# Altium schematic sheet Cigarette-Smoke-Detection-and-Odor-Neutralization-Robot.SchDoc
size A4; SheetNumber: 1; SheetTotal: 1
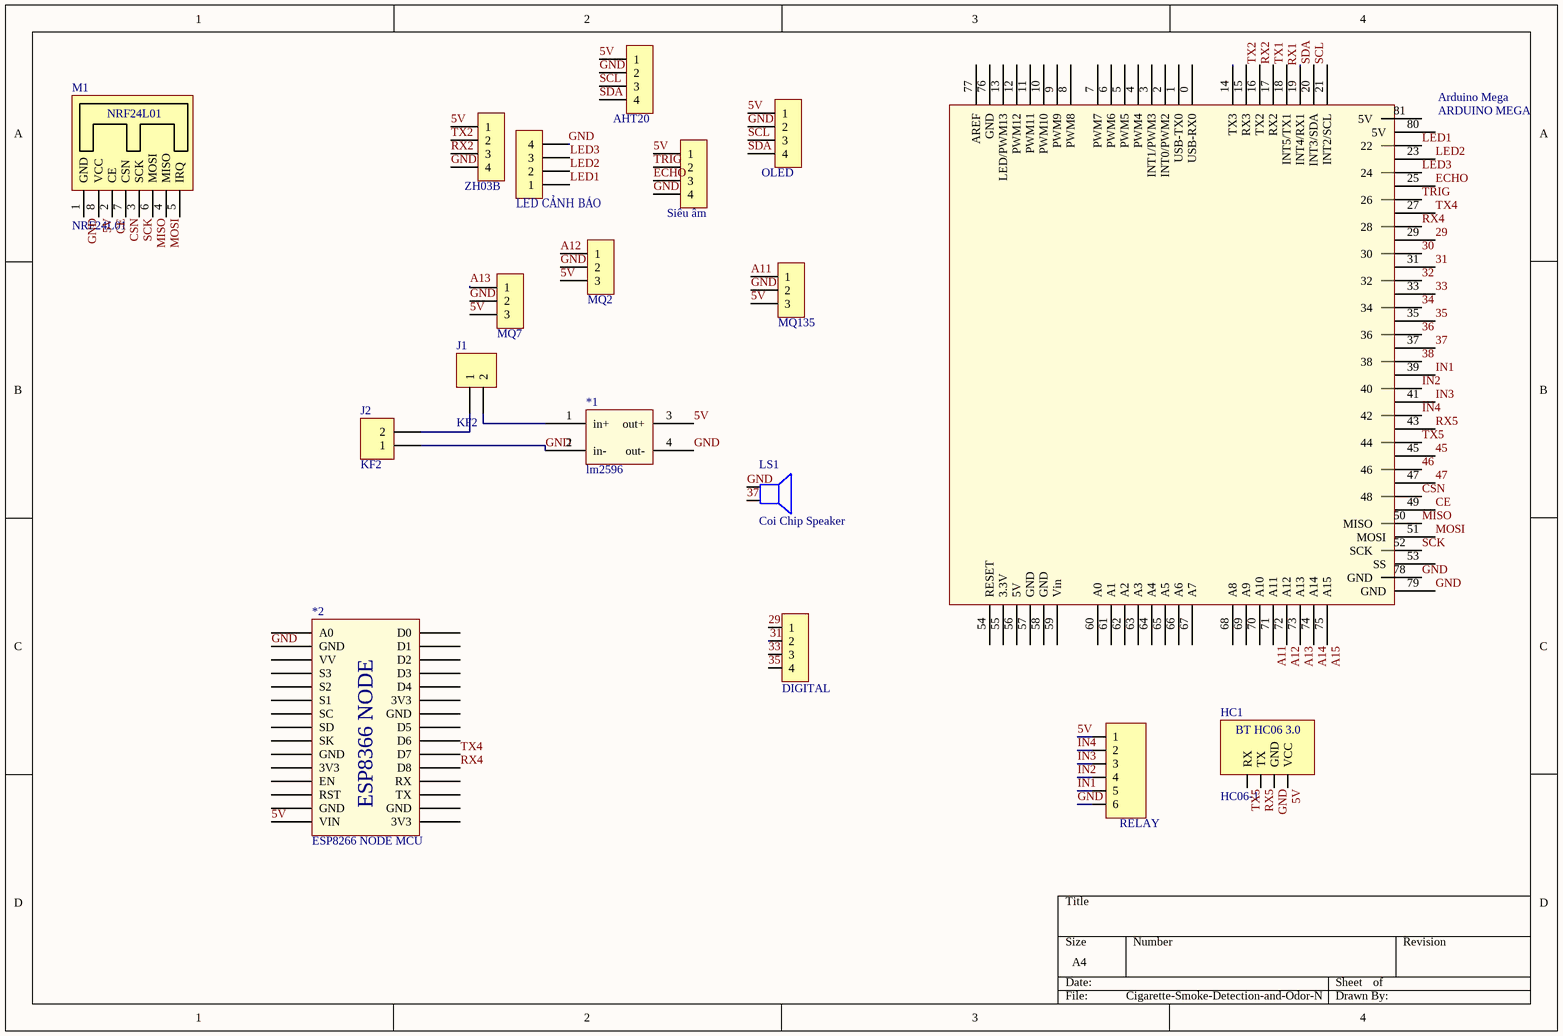
[diagram p0: Cigarette-Smoke-Detection-and-Odor-Neutralization-Robot.SchDoc]

## Parts
*1  lm2596  [PCBComponent_1]
*2  ESP8266 NODE MCU  [ESP8266 NODE MCU]
Arduino_Mega  ARDUINO MEGA  [ARDUINO MEGA]
H1  AHT20  [XH2.54M-4]
H2  OLED  [XH2.54M-4]
H3  ZH03B  [XH2.54M-4]
H4  LED CẢNH BÁO  [XH2.54M-4]
H5  Siêu âm  [XH2.54M-4]
H6  MQ2  [XH2.54M-3]
H7  MQ135  [XH2.54M-3]
H8  MQ7  [XH2.54M-3]
H9  RELAY  [JP 1x6 DT]
HC1  HC06-1  [HC06-1]
J1  KF2  [KF2-3.5]
J2  KF2  [KF2-3.5]
JP1  DIGITAL  [JP 1x4 DT]
LS1  Coi Chip Speaker  [Coi Chip Speacker]
M1  NRF24L01  [NRF24L01]

## Nets
5V: *1.3(out+) *2.15(VIN) H1.1 H2.1 H3.1 H5.1 H6.3 H7.3 H8.3 H9.1 HC1.4(VCC) M1.8(VCC)
29: Arduino_Mega.29 JP1.1
30: Arduino_Mega.30
31: Arduino_Mega.31 JP1.2
32: Arduino_Mega.32
33: Arduino_Mega.33 JP1.3
34: Arduino_Mega.34
35: Arduino_Mega.35 JP1.4
36: Arduino_Mega.36
37: Arduino_Mega.37 LS1.2
38: Arduino_Mega.38
45: Arduino_Mega.45
46: Arduino_Mega.46
47: Arduino_Mega.47
A11: Arduino_Mega.71(A11) H7.1
A12: Arduino_Mega.72(A12) H6.1
A13: Arduino_Mega.73(A13) H8.1
A14: Arduino_Mega.74(A14)
A15: Arduino_Mega.75(A15)
CE: Arduino_Mega.49 M1.2(CE)
CSN: Arduino_Mega.48 M1.7(CSN)
ECHO: Arduino_Mega.25 H5.3
GND: *1.2(in-) *1.4(out-) *2.2(GND) Arduino_Mega.78(GND) Arduino_Mega.79(GND) H1.2 H2.2 H3.4 H4.4 H5.4 H6.2 H7.2 H8.2 H9.6 HC1.3(GND) J2.1 LS1.1 M1.1(GND)
IN1: Arduino_Mega.39 H9.5
IN2: Arduino_Mega.40 H9.4
IN3: Arduino_Mega.41 H9.3
IN4: Arduino_Mega.42 H9.2
LED1: Arduino_Mega.22 H4.1
LED2: Arduino_Mega.23 H4.2
LED3: Arduino_Mega.24 H4.3
MISO: Arduino_Mega.50(MISO) M1.6(MOSI)
MOSI: Arduino_Mega.51(MOSI) M1.4(MISO)
RX1: Arduino_Mega.19(INT4/RX1)
RX2: Arduino_Mega.17(RX2) H3.3
RX4: *2.20(D8) Arduino_Mega.28
RX5: Arduino_Mega.43 HC1.2(TX)
SCK: Arduino_Mega.52(SCK) M1.3(SCK)
SCL: Arduino_Mega.21(INT2/SCL) H1.3 H2.3
SDA: Arduino_Mega.20(INT3/SDA) H1.4 H2.4
TRIG: Arduino_Mega.26 H5.2
TX1: Arduino_Mega.18(INT5/TX1)
TX2: Arduino_Mega.16(TX2) H3.2
TX4: *2.21(D7) Arduino_Mega.27
TX5: Arduino_Mega.44 HC1.1(RX)
Net*1_1: *1.1(in+) J1.2
NetJ1_1: J1.1 J2.2

Not connected (* = marked no-connect by the designer): *2 1(A0) 3(VV) 4(S3) 5(S2) 6(S1) 7(SC) 8(SD) 9(SK) 10(GND) 11(3V3) 12(EN) 13(RST) 14(GND) 16(3V3) 17(GND) 18(TX) 19(RX) 22(D6) 23(D5) 24(GND) 25(3V3) 26(D4) 27(D3) 28(D2) 29(D1) 30(D0); Arduino_Mega 0(USB-RX0) 1(USB-TX0) 2(INT0/PWM2) 3(INT1/PWM3) 4(PWM4) 5(PWM5) 6(PWM6) 7(PWM7) 8(PWM8) 9(PWM9) 10(PWM10) 11(PWM11) 12(PWM12) 13(LED/PWM13) 14(TX3) 15(RX3) 53(SS) 54(RESET) 55(3.3V) 56(5V) 57(GND) 58(GND) 59(Vin) 60(A0) 61(A1) 62(A2) 63(A3) 64(A4) 65(A5) 66(A6) 67(A7) 68(A8) 69(A9) 70(A10) 76(GND) 77(AREF) 80(5V) 81(5V); M1 5(IRQ)

## Notes on the sheet
- (in symbol ESP8266 NODE MCU) ESP8366 NODE
- (in symbol HC06-1) BT HC06 3.0

## Library data of the parts
H1-H5 = Header 4P 2.54 Duc Thang: Cắm; Ten_Linh_Kien: Header 4P XH2.54-4P Đực Thẳng; Don_Vi: Con; Ma_Hang: MH001285; Chung_Loai: Cắm
H6-H8 = Header 3P 2.54 Duc Thang: Cắm; Ten_Linh_Kien: Header 3P XH2.54-3P Đực Thẳng; Don_Vi: Con; Ma_Hang: MH001292; Chung_Loai: Cắm
H9 = JP 1x6 2.54 Duc Thang: Cắm; Ten_Linh_Kien: Jump Đơn Đực 2.54MM 1x40P Thẳng 11MM; Don_Vi: Con; Ma_Hang: MH000903; Ghi_Chu: *; Kieu_Chan: *; Chung_Loai: Cắm
HC1 = HC06-1: Manufacturer: W¨¹rth Elektronik eiSos GmbH; partNo: 613004143121; ComponentLink1 Description: Manufacturer; ComponentLink2 Description: Datasheet; NoPins: 04; Created Date: 29 March 2013; ComponentLink1URL: http://www.we-online.com; ComponentLink2URL: http://katalog.we-online.de/em/datasheet/6130xx143121.pdf; Created by: Karrer Zheng
J1 J2 = KF2: Manufacturer: Würth Elektronik eiSos GmbH; partNo: 691103110002; ComponentLink1 Description: Manufacturer; ComponentLink2 Description: Datasheet; NoPins: 2; Created Date: 29 October 2013; ComponentLink1URL: http://www.we-online.com; ComponentLink2URL: http://katalog.we-online.de/em/datasheet/6911031100xx.pdf; Created by: Karrer Zheng
JP1 = JP 1x4 2.54 Duc Thang: Cắm; Ten_Linh_Kien: Jump Đơn Đực 2.54MM 1x40P Thẳng 11MM; Don_Vi: Con; Ma_Hang: MH000903; Ghi_Chu: *; Kieu_Chan: *; Chung_Loai: Cắm
LS1 = Coi Chip Speaker: Còi chip